# EAGLE schematic B3606 (EAGLE 6.3)
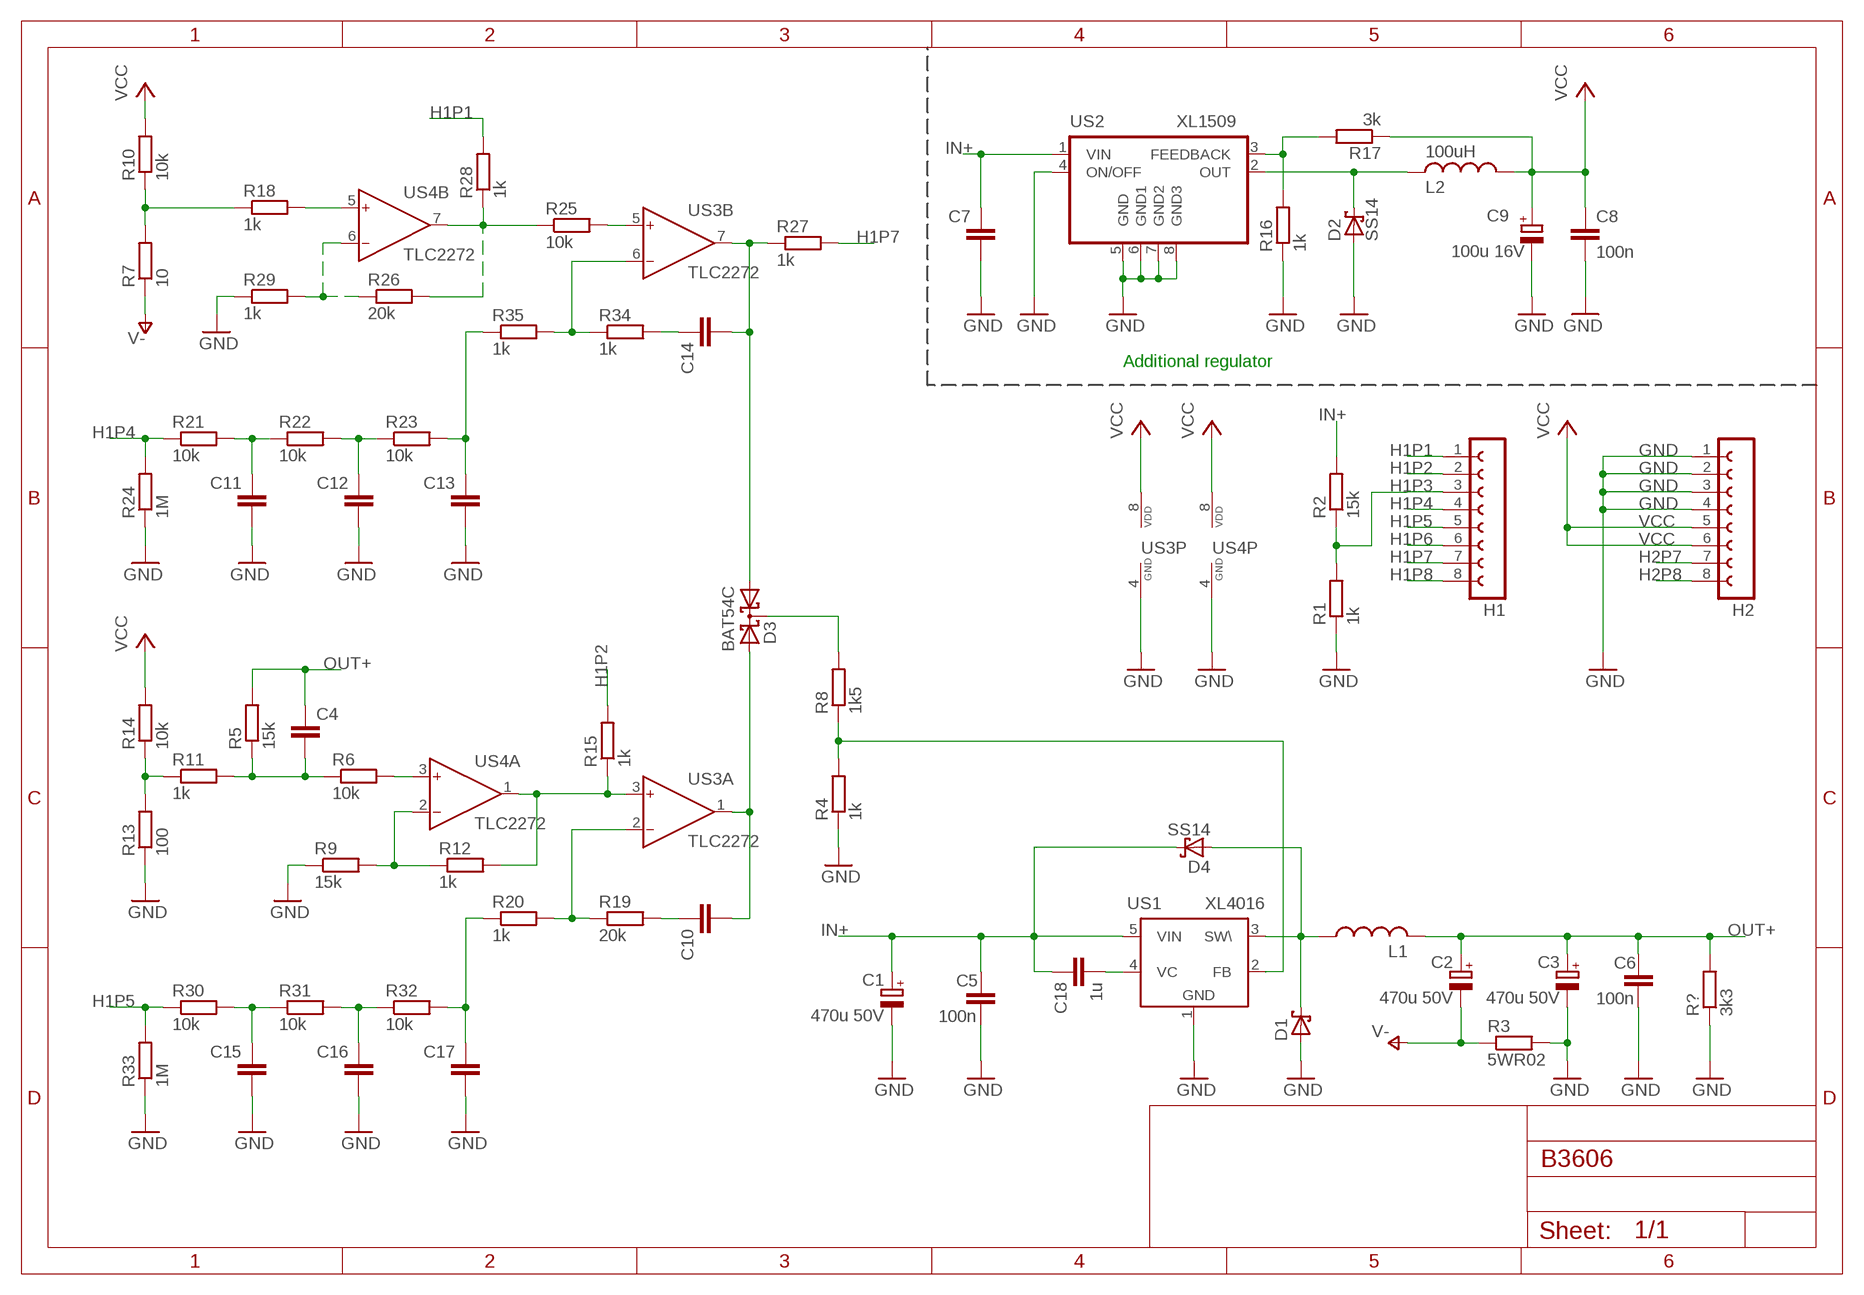
[diagram p0: schematic, sheet 1]

## Parts
C1  470u 50V  CPOL-EUE2.5-7  [E2,5-7]
C2  470u 50V  CPOL-EUE2.5-7  [E2,5-7]
C3  470u 50V  CPOL-EUE2.5-7  [E2,5-7]
C4  C-EU025-025X050  [C025-025X050]
C5  100n  C-EU025-025X050  [C025-025X050]
C6  100n  C-EU025-025X050  [C025-025X050]
C7  C-EUC2012  [C2012]
C8  100n  C-EU025-025X050  [C025-025X050]
C9  100u 16V  CPOL-EUE2.5-7  [E2,5-7]
C10  C-EUC2012  [C2012]
C11  C-EUC2012  [C2012]
C12  C-EUC2012  [C2012]
C13  C-EUC2012  [C2012]
C14  C-EUC2012  [C2012]
C15  C-EUC2012  [C2012]
C16  C-EUC2012  [C2012]
C17  C-EUC2012  [C2012]
C18  1u  C-EU025-025X050  [C025-025X050]
D1  MBR1060  [TO−220AC]
D2  SS14  [DO214AC]
D3  BAT54C  [SOT23]
D4  SS14  [DO214AC]
H1  FE08-1  [FE08]
H2  FE08-1  [FE08]
L1  L-USTJ3-U1  [TJ3-U1]
L2  100uH  L-USTJ3-U1  [TJ3-U1]
R1  1k  R-EU_R2012  [R2012]
R2  15k  R-EU_R2012  [R2012]
R3  5WR02  R-EU_0309/10  [0309/10]
R4  1k  R-EU_R2012  [R2012]
R5  15k  R-EU_0207/10  [0207/10]
R6  10k  R-EU_R2012  [R2012]
R7  10  R-EU_R2012  [R2012]
R8  1k5  R-EU_R2012  [R2012]
R9  15k  R-EU_R2012  [R2012]
R10  10k  R-EU_R2012  [R2012]
R11  1k  R-EU_R2012  [R2012]
R12  1k  R-EU_R2012  [R2012]
R13  100  R-EU_R2012  [R2012]
R14  10k  R-EU_R2012  [R2012]
R15  1k  R-EU_R2012  [R2012]
R16  1k  R-EU_R2012  [R2012]
R17  3k  R-EU_R2012  [R2012]
R18  1k  R-EU_R2012  [R2012]
R19  20k  R-EU_R2012  [R2012]
R20  1k  R-EU_R2012  [R2012]
R21  10k  R-EU_R2012  [R2012]
R22  10k  R-EU_R2012  [R2012]
R23  10k  R-EU_R2012  [R2012]
R24  1M  R-EU_R2012  [R2012]
R25  10k  R-EU_R2012  [R2012]
R26  20k  R-EU_R2012  [R2012]
R27  1k  R-EU_R2012  [R2012]
R28  1k  R-EU_R2012  [R2012]
R29  1k  R-EU_R2012  [R2012]
R30  10k  R-EU_R2012  [R2012]
R31  10k  R-EU_R2012  [R2012]
R32  10k  R-EU_R2012  [R2012]
R33  1M  R-EU_R2012  [R2012]
R34  1k  R-EU_R2012  [R2012]
R35  1k  R-EU_R2012  [R2012]
R?  3k3  R-EU_0207/10  [0207/10]
US1  XL4016  [TO220-5L]
US2  XL1509  [SOP-08]
US3  TLC2272  [SOP-08]
US4  TLC2272  [SOP-08]

## Nets
FB: R4.2 R8.1 US1.2(FB)
GND: C1.- C3.- C5.2 C6.2 C7.2 C8.2 C9.- C11.2 C12.2 C13.2 C15.2 C16.2 C17.2 D1.A D2.A H2.1 H2.2 H2.3 H2.4 R1.1 R3.2 R4.1 R9.1 R13.1 R16.1 R24.1 R29.1 R33.1 R?.1 US1.1(GND) US2.4(ON/OFF) US2.5(GND) US2.6(GND1) US2.7(GND2) US2.8(GND3) US3.4(P:GND) US4.4(P:GND)
H1P1: H1.1 R28.2
H1P2: H1.2 R15.2
H1P3: H1.3 R1.2 R2.1
H1P4: H1.4 R21.1 R24.2
H1P5: H1.5 R30.1 R33.2
H1P6: H1.6
H1P7: H1.7 R27.2
H1P8: H1.8
H2P7: H2.7
H2P8: H2.8
IN+: C1.+ C5.1 C7.1 C18.1 D4.C R2.2 US2.1(VIN)
N$1: C18.2 US1.4(VC)
N$2: C10.2 D3.2(A2) US3.1(A:1OUT)
N$3: C15.1 R30.2 R31.1
N$4: R6.2 US4.3(A:1IN+)
N$5: C10.1 R19.2
N$6: R26.1 R29.2 US4.6(B:2IN-)
N$7: C16.1 R31.2 R32.1
N$8: C11.1 R21.2 R22.1
N$9: C14.1 R34.2
N$10: C13.1 R23.2 R35.1
N$11: R34.1 R35.2 US3.6(B:2IN-)
N$12: R7.2 R10.1 R18.1
N$13: C12.1 R22.2 R23.1
N$14: R16.2 R17.2 US2.3(FEEDBACK)
N$15: D2.C L2.2 US2.2(OUT)
N$16: R25.2 US3.5(B:2IN+)
N$17: D1.C D4.A L1.1
N$18: R19.1 R20.2 US3.2(A:1IN-)
N$19: C17.1 R20.1 R32.2
N$20: R9.2 R12.1 US4.2(A:1IN-)
N$21: C4.2 R5.1 R6.1 R11.2
N$22: R11.1 R13.2 R14.1
N$23: R18.2 US4.5(B:2IN+)
N$100: D3.3(CC) R8.2
OUT+: C2.+ C3.+ C4.1 C6.1 L1.2 R5.2 R?.2
PIN7: C14.2 D3.1(A1) R27.1 US3.7(B:2OUT)
US4_1OUT: R12.2 R15.1 US3.3(A:1IN+) US4.1(A:1OUT)
US4_2OUT: R25.1 R26.2 R28.1 US4.7(B:2OUT)
V-: C2.- R3.1 R7.1
VCC: C8.1 C9.+ H2.5 H2.6 L2.1 R10.2 R14.2 R17.1 US3.8(P:VDD) US4.8(P:VDD)
Unconnected: US1.3(SW\) US1.5(VIN)

## Notes on the sheet
- Additional regulator

## Library data of the parts
C1-C3 C9 = resistor:CPOL-EU: POLARIZED CAPACITOR, European symbol
C4-C8 C10-C18 = resistor:C-EU: CAPACITOR, European symbol
D1 = onsemi:MBR1060: SCHOTTKY DIODE 10 AMPERES, 60 VOLTS
D2 D4 = s1x_10:SS14: Schottky diode 40V 1A DO214AC
D3 = diode:BAT54C: Schottky Diodes Source: Fairchild .. BAT54.pdf
H1 H2 = con-lsta:FE08-1: FEMALE HEADER; OC_FARNELL: unknown; OC_NEWARK: unknown
L1 L2 = resistor:L-US: INDUCTOR, American symbol
R1-R35 R? = resistor:R-EU_: RESISTOR, European symbol
US1 = xlsemi:XL4016
US2 = xlsemi:XL1509: 2A 150KHz 40V Buck DC to DC Converter
US3 US4 = texas:TLC2272: Advanced LinCMOS Rail-to-Rail Operational Amplifiers